# EAGLE design MotorController (EAGLE 9.2.0)
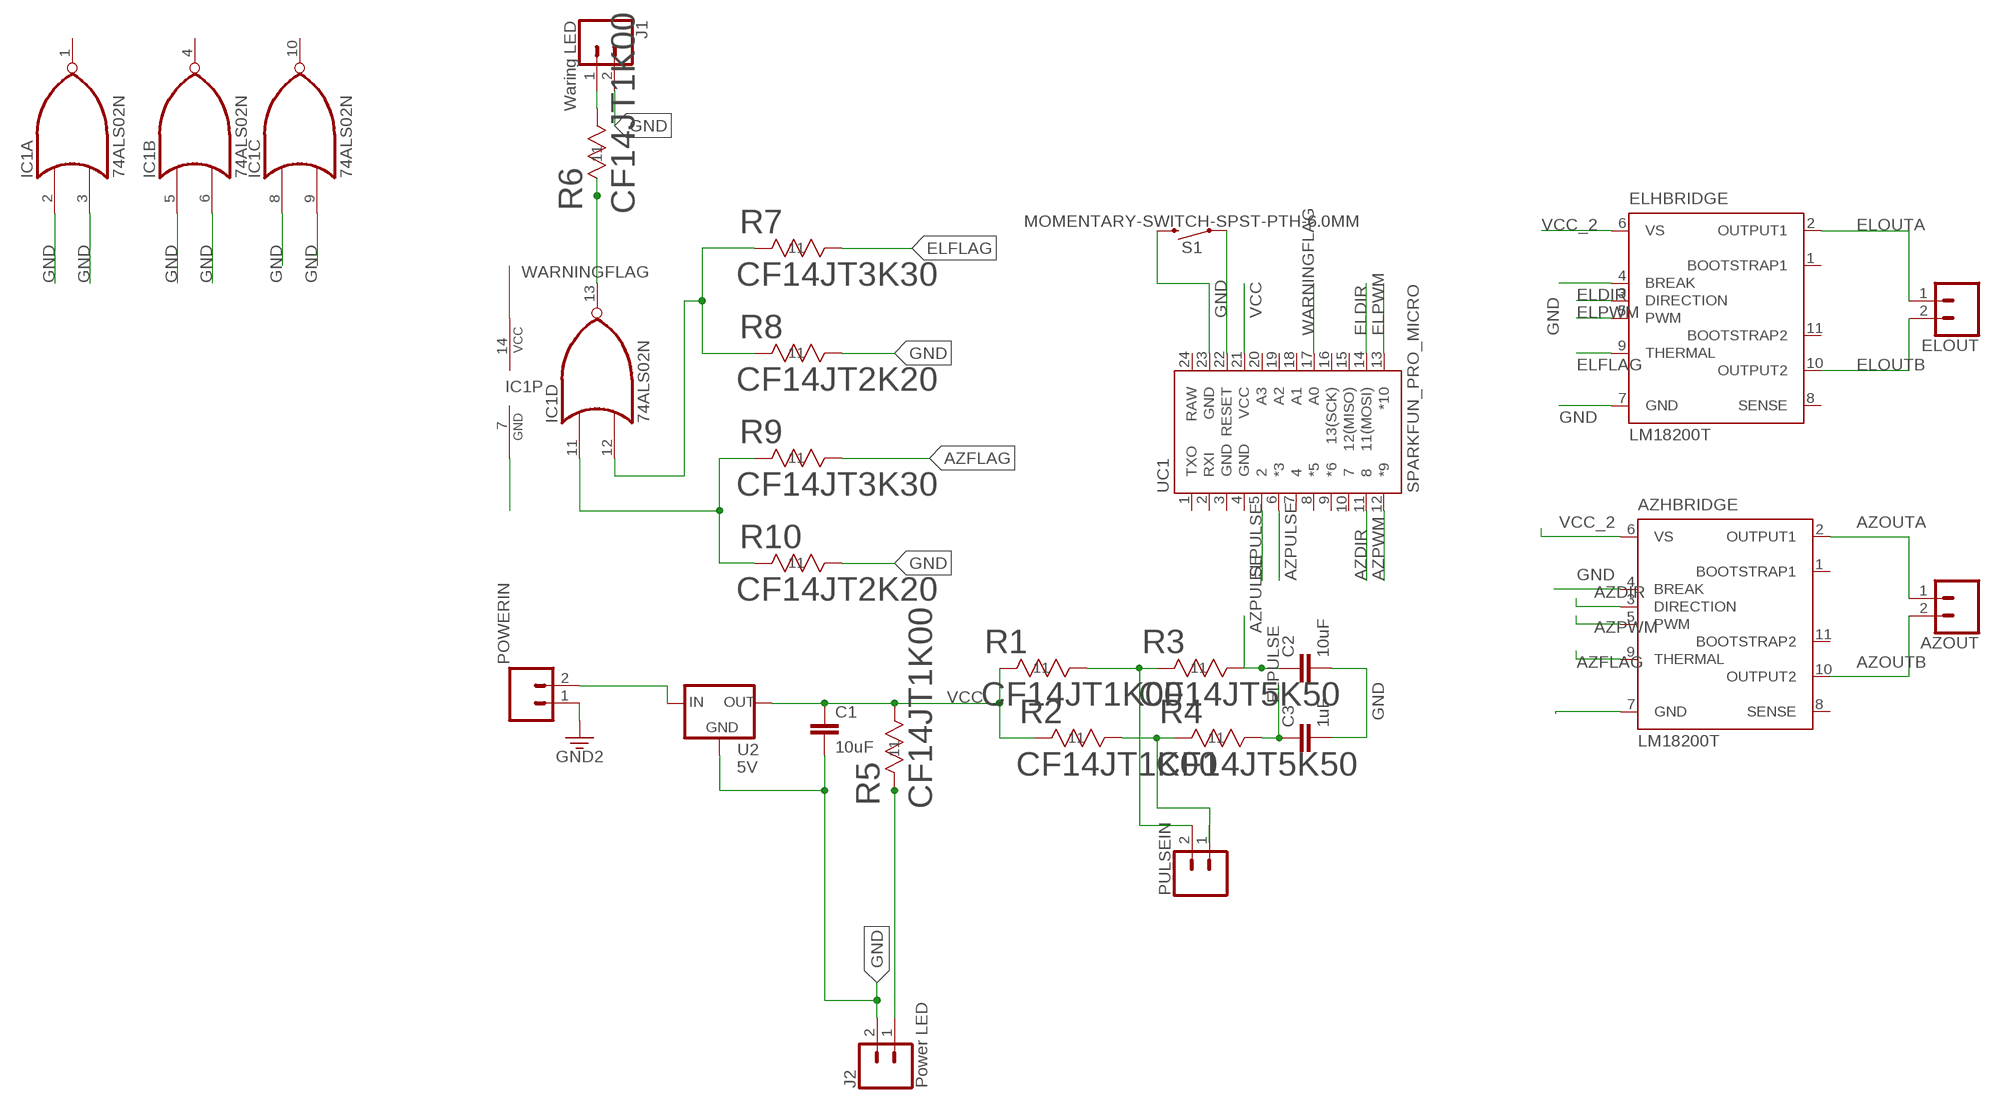
[diagram p0: schematic, sheet 1]

## Parts
AZHBRIDGE  LM18200T  [TO-220-11]
AZOUT  CONN_02  [1X02]
C1  10uF  0.1UF-KIT-EZ-50V-20%  [CAP-PTH-SMALL-KIT]
C2  10uF  0.1UF-KIT-EZ-50V-20%  [CAP-PTH-SMALL-KIT]
C3  1uF  0.1UF-KIT-EZ-50V-20%  [CAP-PTH-SMALL-KIT]
ELHBRIDGE  LM18200T  [TO-220-11]
ELOUT  CONN_02  [1X02]
IC1  74ALS02N  [DIL14]
J1  Waring LED  CONN_02  [1X02]
J2  Power LED  CONN_02  [1X02]
POWERIN  CONN_02  [1X02]
PULSEIN  CONN_02  [1X02]
R1  CF14JT1K00  [STA_CF14]
R2  CF14JT1K00  [STA_CF14]
R3  CF14JT5K50  CF14JT1K00  [STA_CF14]
R4  CF14JT5K50  CF14JT1K00  [STA_CF14]
R5  CF14JT1K00  [STA_CF14]
R6  CF14JT1K00  [STA_CF14]
R7  CF14JT3K30  CF14JT1K00  [STA_CF14]
R8  CF14JT2K20  CF14JT1K00  [STA_CF14]
R9  CF14JT3K30  CF14JT1K00  [STA_CF14]
R10  CF14JT2K20  CF14JT1K00  [STA_CF14]
S1  MOMENTARY-SWITCH-SPST-PTH-6.0MM  [TACTILE_SWITCH_PTH_6.0MM]
U2  5V  V_REG_78XXSINK  [TO220-IGO]
UC1  SPARKFUN_PRO_MICRO  [SPARKFUN_PRO_MICRO]

## Nets
AZDIR: AZHBRIDGE.3(DIRECTION) UC1.11
AZFLAG: AZHBRIDGE.9(THERMAL) R9.2
AZOUTA: AZHBRIDGE.2(OUTPUT1) AZOUT.1
AZOUTB: AZHBRIDGE.10(OUTPUT2) AZOUT.2
AZPULSE: C2.1 R3.2 UC1.6(*3)
AZPWM: AZHBRIDGE.5(PWM) UC1.12(*9)
ELDIR: ELHBRIDGE.3(DIRECTION) UC1.14(11(MOSI))
ELFLAG: ELHBRIDGE.9(THERMAL) R7.2
ELOUTA: ELHBRIDGE.2(OUTPUT1) ELOUT.1
ELOUTB: ELHBRIDGE.10(OUTPUT2) ELOUT.2
ELPULSE: C3.1 R4.2 UC1.5
ELPWM: ELHBRIDGE.5(PWM) UC1.13(*10)
GND: AZHBRIDGE.4(BREAK) AZHBRIDGE.7(GND) C1.2 C2.2 C3.2 ELHBRIDGE.4(BREAK) ELHBRIDGE.7(GND) IC1.2(A:I0) IC1.3(A:I1) IC1.5(B:I0) IC1.6(B:I1) IC1.7(P:GND) IC1.8(C:I0) IC1.9(C:I1) J1.2 J2.2 POWERIN.1 R8.2 R10.2 S1.3 U2.GND UC1.23(GND) ; supply symbol labelled GND2
N$1: S1.1 UC1.22(RESET)
N$2: PULSEIN.2 R1.2 R3.1
N$3: IC1.12(D:I1) R7.1 R8.1
N$4: PULSEIN.1 R2.2 R4.1
N$5: J1.1 R6.2
N$8: J2.1 R5.1
N$9: IC1.11(D:I0) R9.1 R10.1
VCC: C1.1 IC1.14(P:VCC) R1.1 R2.1 R5.2 U2.OUT UC1.21(VCC)
VCC_2: AZHBRIDGE.6(VS) ELHBRIDGE.6(VS) POWERIN.2 U2.IN
WARNINGFLAG: IC1.13(D:O) R6.1 UC1.17(A0)
Unconnected: AZHBRIDGE.1(BOOTSTRAP1) AZHBRIDGE.8(SENSE) AZHBRIDGE.11(BOOTSTRAP2) ELHBRIDGE.1(BOOTSTRAP1) ELHBRIDGE.8(SENSE) ELHBRIDGE.11(BOOTSTRAP2) IC1.1(A:O) IC1.4(B:O) IC1.10(C:O) UC1.1(TXO) UC1.2(RXI) UC1.7 UC1.8(*5) UC1.9(*6) UC1.10 UC1.15(12(MISO)) UC1.16(13(SCK)) UC1.18(A1) UC1.19(A2) UC1.20(A3)

## Power pins joined to a net without a drawn wire
GND: UC1.3(GND) UC1.4(GND)
RAW: UC1.24(RAW)

## Library data of the parts
AZHBRIDGE ELHBRIDGE = national-semiconductor:LM18200T: 3A, 55V H-Bridge Motor Control SourcE: http://cache.national.com/ds/LM/LMD18200.pdf; OC_FARNELL: unknown; OC_NEWARK: unknown
AZOUT ELOUT J1 J2 POWERIN PULSEIN = SparkFun-Connectors:CONN_02: Multi connection point. Often used as Generic Header-pin footprint for 0.1 inch spaced/style header connections On any of the 0.1 inch spaced packages, you can populate with these: Break Away Headers - Straight <https://www.sparkfun.com/products/116> (PRT-00116) Break Away Male Headers - Right Angle <https://www.sparkfun.com/products/553> (PRT-00553) Female Headers <https://www.sparkfun.com/products/115> (PRT-00115) Break Away Headers - Machine Pin <https://www.sparkfun.com/products/117> (PRT-00117) Break Away Female Headers - Swiss Machine Pin <https://www.sparkfun.com/products/743> (PRT-00743) For SCREWTERMINALS and SPRING TERMINALS visit here: Screw Terimnals on SparkFun.com <https://www.sparkfun.com/search/results?term=Screw+Terminals> (5mm/3.5mm/2.54mm spacing) This device is also useful as a general connection point to wire up your design to another part of your project. Our various solder wires solder well into these plated through hole pads. Hook-Up Wire - Assortment (Stranded, 22 AWG) <https://www.sparkfun.com/products/11375> (PRT-11375) Hook-Up Wire - Assortment (Solid Core, 22 AWG) <https://www.sparkfun.com/products/11367> (PRT-11367) View the entire wire category on our website here <https://www.sparkfun.com/categories/141> Special notes: Molex polarized connector foot print use with: PRT-08233 with associated crimp pins and housings. 2.54_SCREWTERM for use with PRT-10571. 3.5mm Screw Terminal footprints for PRT-08084 5mm Screw Terminal footprints for use with PRT-08432
C1-C3 = SparkFun-Capacitors:0.1UF: 0.1µF ceramic capacitors A capacitor is a passive two-terminal electrical component used to store electrical energy temporarily in an electric field.; PROD_ID: CAP-08370; VALUE: 0.1uF
IC1 = 74xx-us:74*02: Quad 2-input NOR gate
R1-R10 = DigiKeyImports:CF14JT1K00; MANUFACTURER_PART_NUMBER: CF14JT1K00; VENDOR: Stackpole International
S1 = SparkFun-Switches:MOMENTARY-SWITCH-SPST: Momentary Switch (Pushbutton) - SPST Normally-open (NO) SPST momentary switches (buttons, pushbuttons). Variants PTH-12MM - 12mm square, through-hole Momentary Pushbutton Switch - 12mm Square <https://www.sparkfun.com/products/9190> (COM-09190) PTH-6.0MM, PTH-6.0MM-KIT - 6.0mm square, through-hole Mini Pushbutton Switch <https://www.sparkfun.com/products/97> (COM-00097) KIT package intended for soldering kit's - only one side of pads' copper is exposed. PTH-RIGHT-ANGLE-KIT - Right-angle, through-hole Right Angle Tactile Button <https://www.sparkfun.com/products/10791> - Used on SparkFun BigTime Watch Kit <https://www.sparkfun.com/products/11734> SMD-12MM - 12mm square, surface-mount Tactile Button - SMD (12mm) <https://www.sparkfun.com/products/12993> (COM-12993) Used on SparkFun PicoBoard <https://www.sparkfun.com/products/11888> SMD-4.5MM - 4.5mm Square Trackball Switch Used on SparkFun Blackberry Trackballer Breakout <https://www.sparkfun.com/products/13169> SMD-4.6MMX2.8MM - 4.60mm x 2.80mm, surface mount Used on SparkFun SAMD21 Mini Breakout <https://www.sparkfun.com/products/13664> SMD-5.2MM, SMD-5.2-REDUNDANT - 5.2mm square, surface-mount Mini Pushbutton Switch - SMD <https://www.sparkfun.com/products/8720> (COM-08720) Used on Arduino Pro Mini <https://www.sparkfun.com/products/11114> REDUNDANT package connects both switch circuits together SMD-6.0X3.5MM - 6.0 x 3.5mm, surface mount Momentary Reset Switch SMD <https://www.sparkfun.com/products/8229> (COM-08229) SMD-6.2MM-TALL - 6.2mm square, surface mount Tactile Button - SMD (6mm) <https://www.sparkfun.com/products/12992> Used on SparkFun Digital Sandbox <https://www.sparkfun.com/products/12651> SMD-RIGHT-ANGLE - Right-angle, surface mount Used on SparkFun Block for Intel® Edison - Arduino <https://www.sparkfun.com/products/13036>; PROD_ID: SWCH-08441; SF_SKU: COM-00097
U2 = SparkFun-IC-Power:V_REG_78XX: Voltage Regulator Standard 78xx regulator. IGO (Input Ground Output). Spark Fun Electronics SKU : COM-00107
UC1 = SparkFun-Boards:SPARKFUN_PRO_MICRO: SparkFun Pro Micro Atmega32U4 compatible footprint. SparkFun Products: 3.3V/8MHz <https://www.sparkfun.com/products/12587> 5V/16MHz <https://www.sparkfun.com/products/12640>

## Board
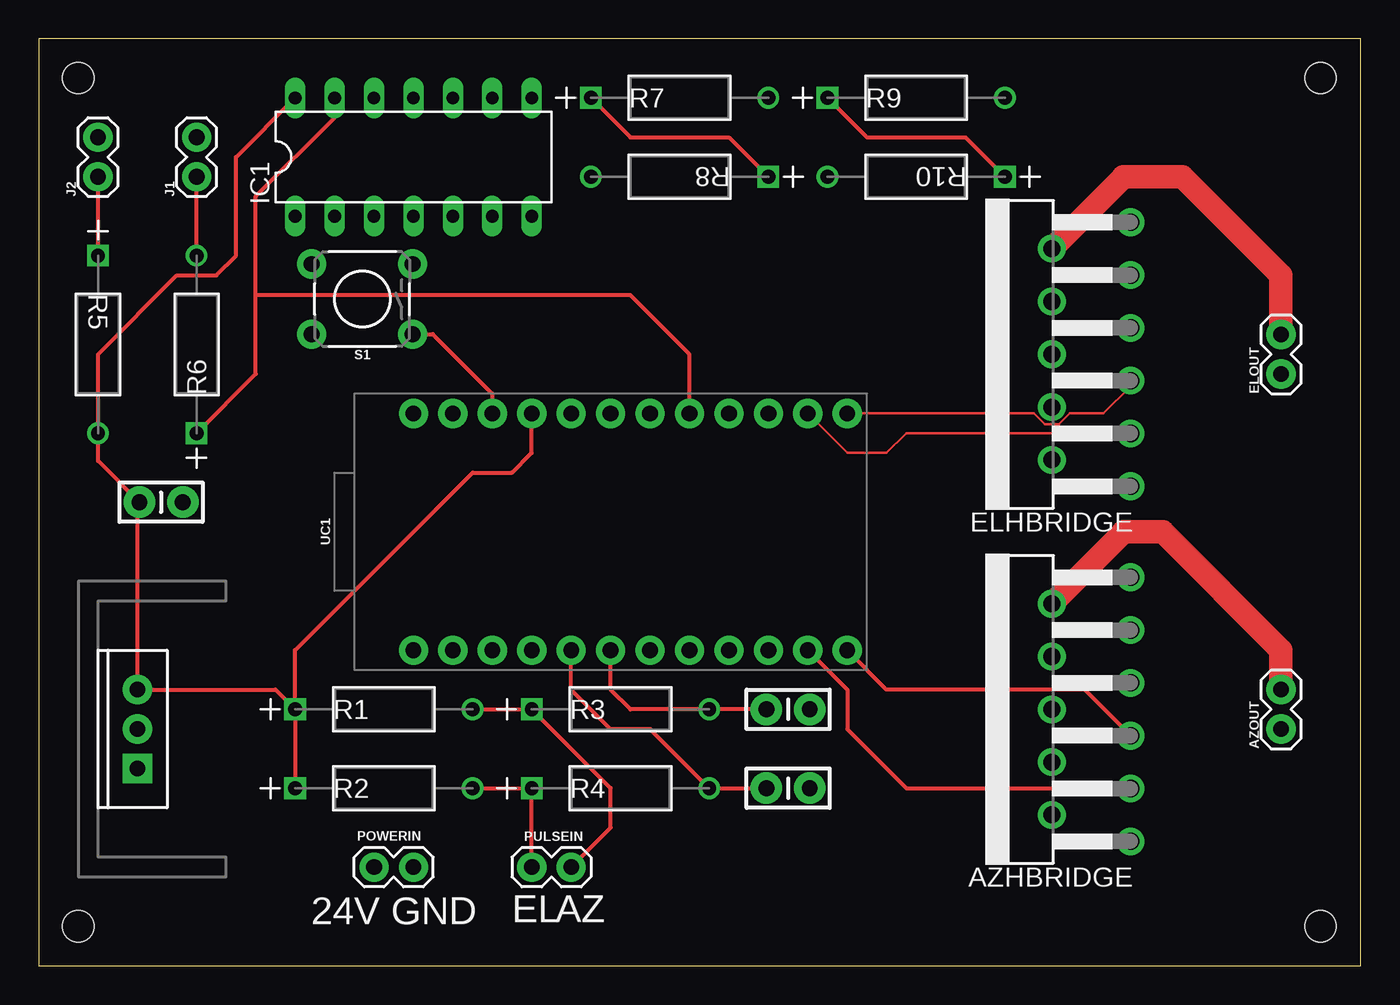
[diagram p1: board, top side]
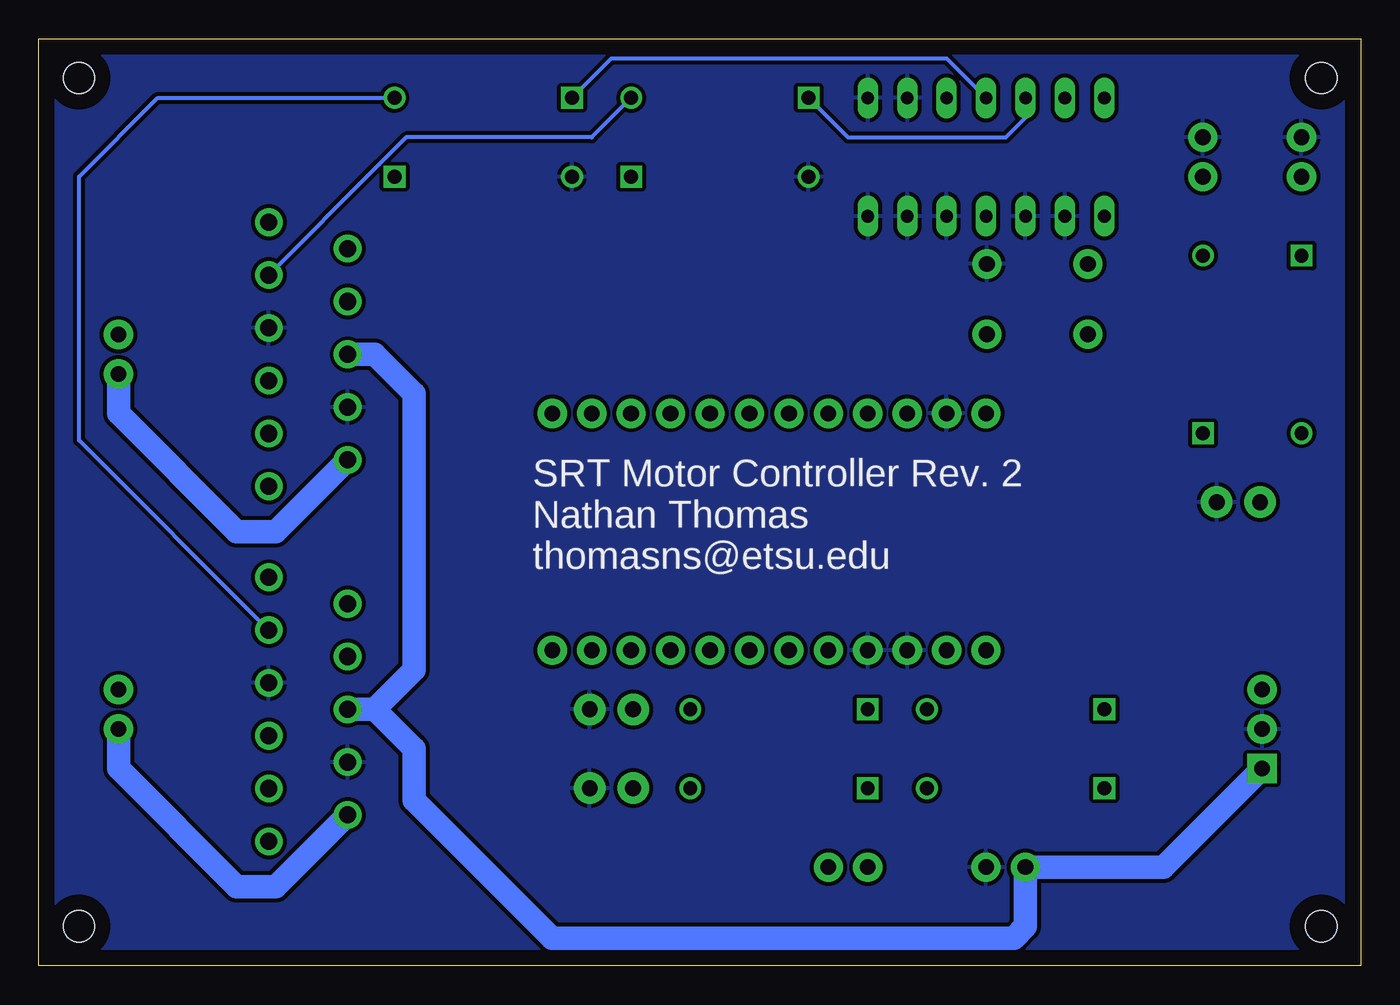
[diagram p2: board, bottom side, seen from below]

Size 85.14 x 59.68 mm. Coordinates in mm from the lower left corner, seen from the top.
Outline: 0,0 85.14,0 85.14,59.68 0,59.68 0,0
Copper layers (1*16): Top 0.035mm / dielectric 1.5mm / Bottom 0.035mm
Design rules "default": minimum track width 6mil, minimum drill 0.35mm, track to track 6mil, track to pad 6mil, pad to pad 6mil, via to via 6mil, smd to smd 6mil, copper to edge 40mil, drill to drill 6mil, minimum pad ring 10mil, minimum via ring 8mil, stop-mask expansion 4mil, vias tented up to drill 0mil, thermal gap 10mil
Holes 2 mm at 2.54,57.15 82.55,57.15 82.55,2.54 2.54,2.54

### Footprints (pad centres in the part's own frame; a part is rotated, then mirrored left to right if it is on the bottom)
TO-220-11 = drill 1.1 pad 1.778: 1 -8.5,-9.37; 2 -6.8,-4.29; 3 -5.1,-9.37; 4 -3.4,-4.29; 5 -1.7,-9.37; 6 0,-4.29; 7 1.7,-9.37; 8 3.4,-4.29; 9 5.1,-9.37; 10 6.8,-4.29; 11 8.5,-9.37
1X02 = drill 1.016 pad 1.88: 1 0,0; 2 2.54,0
CAP-PTH-SMALL-KIT = drill 1.016 pad 2.032: 1 -1.397,0; 2 1.397,0
DIL14 = drill 0.813 long: 1 -7.62,-3.81; 2 -5.08,-3.81; 3 -2.54,-3.81; 4 0,-3.81; 5 2.54,-3.81; 6 5.08,-3.81; 7 7.62,-3.81; 8 7.62,3.81; 9 5.08,3.81; 10 2.54,3.81; 11 0,3.81; 12 -2.54,3.81; 13 -5.08,3.81; 14 -7.62,3.81
STA_CF14 = drill 0.889 pad 1.397 square: 1 -11.43,0 | drill 0.889 pad 1.397: 2 0,0
TACTILE_SWITCH_PTH_6.0MM = drill 1.016 pad 1.88: 1 -3.251,2.261; 2 3.251,2.261; 3 -3.251,-2.261; 4 3.251,-2.261
TO220-IGO = drill 1 pad 1.88: GND 0,0; OUT 2.54,0 | drill 1 pad 1.88 square: IN -2.54,0
SPARKFUN_PRO_MICRO = drill 1.016 pad 1.88: 1 -7.62,12.7; 2 -7.62,10.16; 3 -7.62,7.62; 4 -7.62,5.08; 5 -7.62,2.54; 6 -7.62,0; 7 -7.62,-2.54; 8 -7.62,-5.08; 9 -7.62,-7.62; 10 -7.62,-10.16; 11 -7.62,-12.7; 12 -7.62,-15.24; 13 7.62,-15.24; 14 7.62,-12.7; 15 7.62,-10.16; 16 7.62,-7.62; 17 7.62,-5.08; 18 7.62,-2.54; 19 7.62,0; 20 7.62,2.54; 21 7.62,5.08; 22 7.62,7.62; 23 7.62,10.16; 24 7.62,12.7

### Placement (x,y rotation side)
AZHBRIDGE  60.96,16.51 90 top
AZOUT  80.01,15.24 90 top
C1  7.87,29.84 0 top
C2  48.26,16.51 0 top
C3  48.26,11.43 0 top
ELHBRIDGE  60.96,39.37 90 top
ELOUT  80.01,38.1 90 top
IC1  24.13,52.07 0 top
J1  10.16,50.8 90 top
J2  3.81,50.8 90 top
POWERIN  24.13,6.35 180 top
PULSEIN  31.75,6.35 0 top
R1  27.94,16.51 0 top
R2  27.94,11.43 0 top
R3  43.18,16.51 0 top
R4  43.18,11.43 0 top
R5  3.81,34.29 270 top
R6  10.16,45.72 90 top
R7  46.99,55.88 0 top
R8  35.56,50.8 180 top
R9  62.23,55.88 0 top
R10  50.8,50.8 180 top
S1  20.83,42.93 180 top
U2  6.35,15.24 90 top
UC1  36.83,27.94 90 top

### Tracks (layer width: path | path; a pad name or v marks a point on that pad's centre or on a via)
AZDIR
  Top 0.254: UC1.11 52.07,17.78 52.07,15.24 55.9,11.41 AZHBRIDGE.3
AZFLAG
  Bottom 0.254: AZHBRIDGE.9 82.55,33.83 82.55,50.8 77.47,55.88 R9.2
AZOUTA
  Bottom 1.524: AZHBRIDGE.2 69.88,5.08 72.39,5.08 80.01,12.7 AZOUT.1
AZOUTB
  Top 1.524: AZHBRIDGE.10 69.85,27.91 69.85,27.94 72.39,27.94 80.01,20.32 AZOUT.2
AZPULSE
  Top 0.254: UC1.6 36.83,17.78 38.1,16.51 R3.2 C2.1
AZPWM
  Top 0.254: UC1.12 54.61,17.78 67.36,17.78 AZHBRIDGE.5
ELDIR
  Top 0.152: UC1.14 52.07,33.02 54.61,33.02 55.88,34.29 70.31,34.29 ELHBRIDGE.3
ELFLAG
  Bottom 0.254: ELHBRIDGE.9 63.21,51.59 63.21,51.61 61.48,53.34 49.53,53.34 R7.2
ELOUTA
  Bottom 1.524: ELHBRIDGE.2 69.88,27.94 72.39,27.94 80.01,35.56 ELOUT.1
ELOUTB
  Top 1.524: ELHBRIDGE.10 69.85,50.77 69.85,50.8 73.66,50.8 80.01,44.45 ELOUT.2
ELPULSE
  Top 0.254: UC1.5 34.29,17.78 36.83,15.24 39.37,15.24 R4.2 C3.1
ELPWM
  Top 0.152: ELHBRIDGE.5 70.31,37.65 70.31,37.28 68.58,35.56 66.42,35.56 65.71,34.85 64.79,34.85 64.08,35.56 UC1.13
GND
  pour Bottom (isolate 0.254): 85.09,59.69 0,59.69 0,0 85.09,0
N$1
  Top 0.254: S1.1 25.38,40.66 29.21,36.83 UC1.22
N$2
  Top 0.254: R1.2 R3.1 36.83,11.43 36.83,8.89 PULSEIN.2
N$3
  Top 0.254: R7.1 38.1,53.34 44.45,53.34 R8.1
  Bottom 0.254: R7.1 33.02,53.34 22.86,53.34 21.59,54.61 IC1.12
N$4
  Top 0.254: R2.2 R4.1 PULSEIN.1
N$5
  Top 0.254: R6.2 J1.1
N$8
  Top 0.254: R5.1 J2.1
N$9
  Top 0.254: R9.1 53.34,53.34 59.69,53.34 R10.1
  Bottom 0.254: R9.1 48.26,58.42 26.67,58.42 IC1.11
VCC
  Top 0.254: 6.48,30.35 C1.1 | C1.1 6.35,29.72 U2.OUT 15.24,17.78 R1.1 | IC1.14 12.7,52.07 12.7,45.72 11.43,44.45 8.89,44.45 3.81,39.37 R5.2 3.81,32.51 C1.1 | R1.1 16.51,20.32 27.94,31.75 30.48,31.75 31.75,33.02 UC1.21 | R1.1 R2.1
VCC_2
  Bottom 1.524: U2.IN 12.7,6.35 POWERIN.2 21.59,2.54 22.35,1.78 52.07,1.78 60.96,10.67 60.96,13.97 63.5,16.51 | AZHBRIDGE.6 63.5,16.51 | 63.5,16.51 60.96,19.05 60.96,36.83 63.5,39.37 ELHBRIDGE.6
WARNINGFLAG
  Top 0.254: IC1.13 19.05,54.61 13.97,49.53 13.97,43.18 | UC1.17 41.91,39.37 38.1,43.18 13.97,43.18 | R6.1 13.97,38.1 13.97,43.18

### Text on the board
tPlace: 24V GND | EL | AZ
bNames: SRT Motor Controller Rev. 2 / Nathan Thomas / thomasns@etsu.edu